# EAGLE design main (EAGLE 9.0.1)
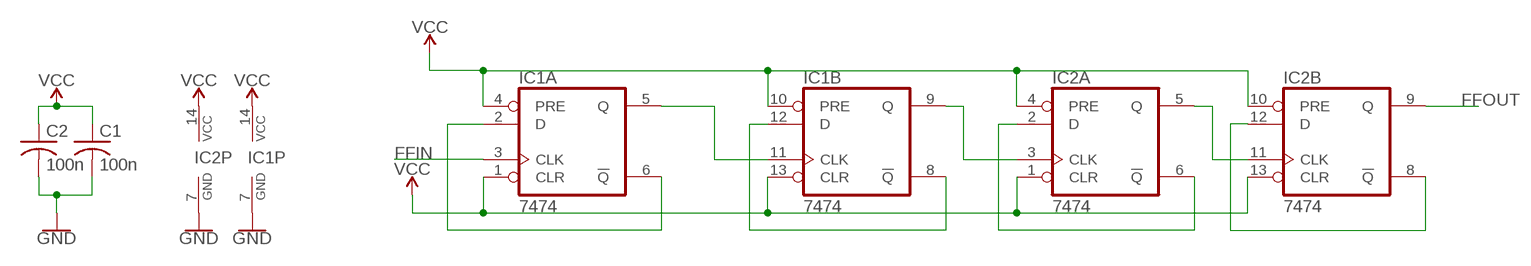
[diagram p0: schematic, sheet 1]

## Parts
C1  100n  C-USC0603  [C0603]
C2  100n  C-USC0603  [C0603]
IC1  7474  [TSSOP14]
IC2  7474  [TSSOP14]

## Nets
FFIN: IC1.3(A:CLK)
FFOUT: IC2.9(B:Q)
GND: C1.2 C2.2 IC1.7(P:GND) IC2.7(P:GND)
N$1: IC1.5(A:Q) IC1.11(B:CLK)
N$2: IC1.2(A:D) IC1.6(A:!Q)
N$3: IC2.2(A:D) IC2.6(A:!Q)
N$4: IC1.8(B:!Q) IC1.12(B:D)
N$5: IC1.9(B:Q) IC2.3(A:CLK)
N$8: IC2.5(A:Q) IC2.11(B:CLK)
N$9: IC2.8(B:!Q) IC2.12(B:D)
VCC: C1.1 C2.1 IC1.1(A:CLR) IC1.4(A:PRE) IC1.10(B:PRE) IC1.13(B:CLR) IC1.14(P:VCC) IC2.1(A:CLR) IC2.4(A:PRE) IC2.10(B:PRE) IC2.13(B:CLR) IC2.14(P:VCC)

## Library data of the parts
C1 C2 = rcl:C-US: CAPACITOR, American symbol; SPICEPREFIX: C
IC1 IC2 = 7_segment_lib:74*74: Dual D type positive edge triggered FLIP FLOP, preset and clear

## Board
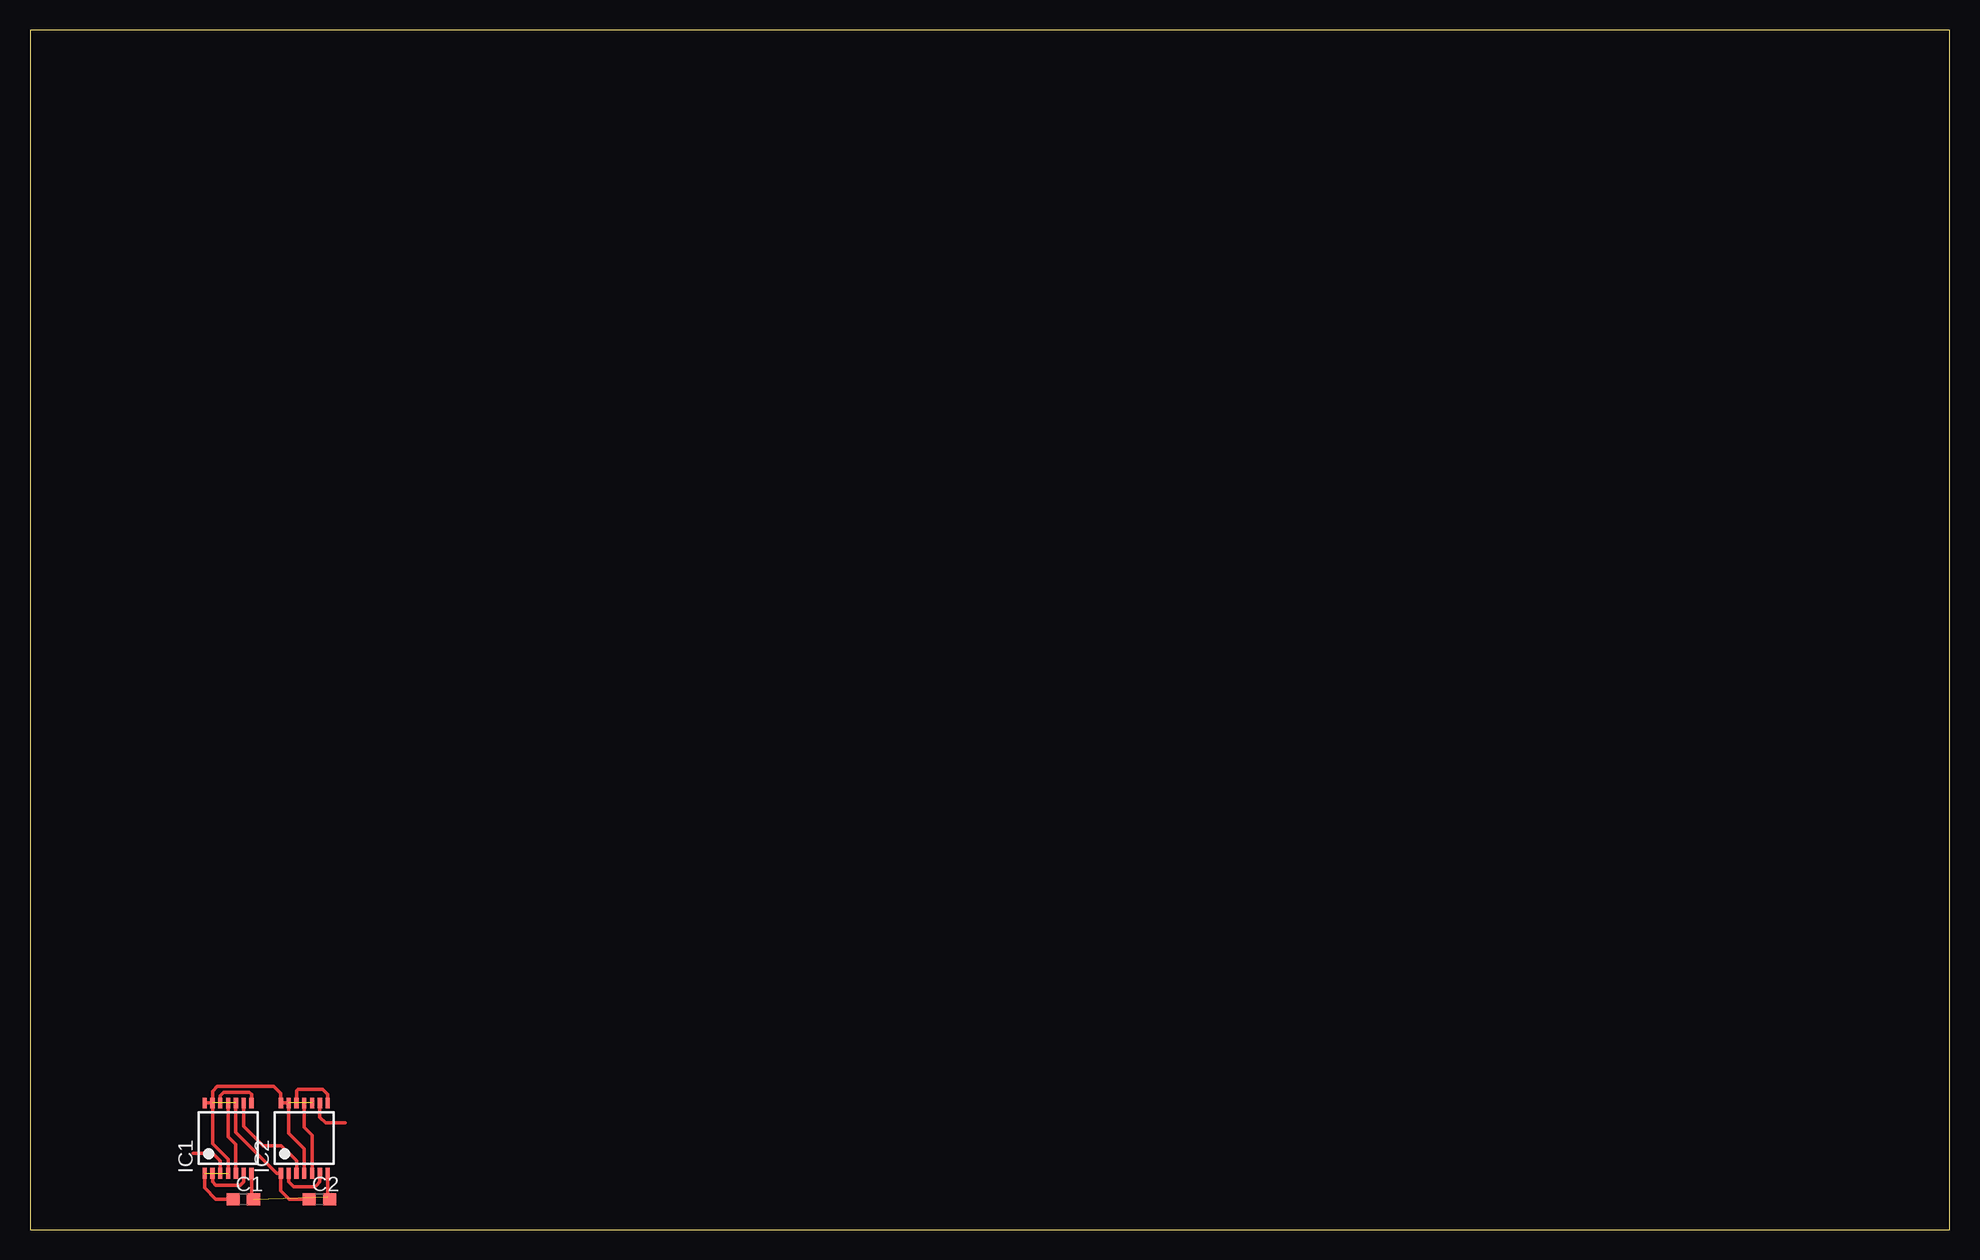
[diagram p1: board, top side]

Size 160 x 100 mm. Coordinates in mm from the lower left corner, seen from the top.
Outline: 0,0 160,0 160,100 0,100 0,0
Copper layers (1*16): Top 0.035mm / dielectric 1.5mm / Bottom 0.035mm
Design rules "default": minimum track width 6mil, minimum drill 0.35mm, track to track 6mil, track to pad 6mil, pad to pad 6mil, via to via 6mil, smd to smd 6mil, copper to edge 40mil, drill to drill 6mil, minimum pad ring 10mil, minimum via ring 8mil, stop-mask expansion 4mil, vias tented up to drill 0mil, thermal gap 10mil

### Footprints (pad centres in the part's own frame; a part is rotated, then mirrored left to right if it is on the bottom)
C0603 = smd 1.1 x 1: 1 -0.85,0; 2 0.85,0
TSSOP14 = smd 0.35 x 0.9: 1 -1.95,-2.925; 2 -1.3,-2.925; 3 -0.65,-2.925; 4 0,-2.925; 5 0.65,-2.925; 6 1.3,-2.925; 7 1.95,-2.925; 8 1.95,2.925; 9 1.3,2.925; 10 0.65,2.925; 11 0,2.925; 12 -0.65,2.925; 13 -1.3,2.925; 14 -1.95,2.925

### Placement (x,y rotation side)
C1  17.78,2.54 0 top
C2  24.13,2.54 0 top
IC1  16.51,7.62 0 top
IC2  22.86,7.62 0 top

### Tracks (layer width: path | path; a pad name or v marks a point on that pad's centre or on a via)
FFIN
  Top 0.305: IC1.3 15.86,5.73 15.24,6.35 13.59,6.35
FFOUT
  Top 0.305: IC2.9 24.16,9.37 24.64,8.89 26.29,8.89
GND  (1 unrouted)
  Top 0.305: IC1.7 18.46,2.71 C1.2 | IC2.7 24.81,2.71 C2.2
N$1
  Top 0.305: IC1.5 17.16,7.1 16.51,7.75 IC1.11
N$2
  Top 0.305: IC1.2 15.21,3.97 15.49,3.68 17.53,3.68 17.81,3.97 IC1.6
N$3
  Top 0.305: IC2.6 24.16,3.97 23.88,3.68 23.75,3.56 21.97,3.56 21.56,3.97 IC2.2
N$4
  Top 0.305: IC1.12 15.86,11.16 16.13,11.43 18.29,11.43 18.46,11.26 IC1.8
N$5
  Top 0.305: IC1.9 17.81,8.61 19.43,6.99 20.95,6.99 22.21,5.73 IC2.3
N$8
  Top 0.305: IC2.5 23.51,7.86 22.86,8.51 IC2.11
N$9
  Top 0.305: IC2.12 22.21,11.54 22.35,11.68 24.38,11.68 24.81,11.26 IC2.8
VCC  (3 unrouted)
  Top 0.305: IC1.4 16.51,5.84 15.21,7.14 IC1.13 | IC1.10 17.16,8.11 20.58,4.7 IC2.1 20.91,3.22 21.59,2.54 C2.1 | IC1.13 IC1.14 | IC1.13 15.21,11.53 15.62,11.94 20.32,11.94 20.91,11.35 IC2.14 IC2.13 21.56,8.03 22.86,6.73 IC2.4 | IC1.1 14.56,3.47 15.49,2.54 C1.1